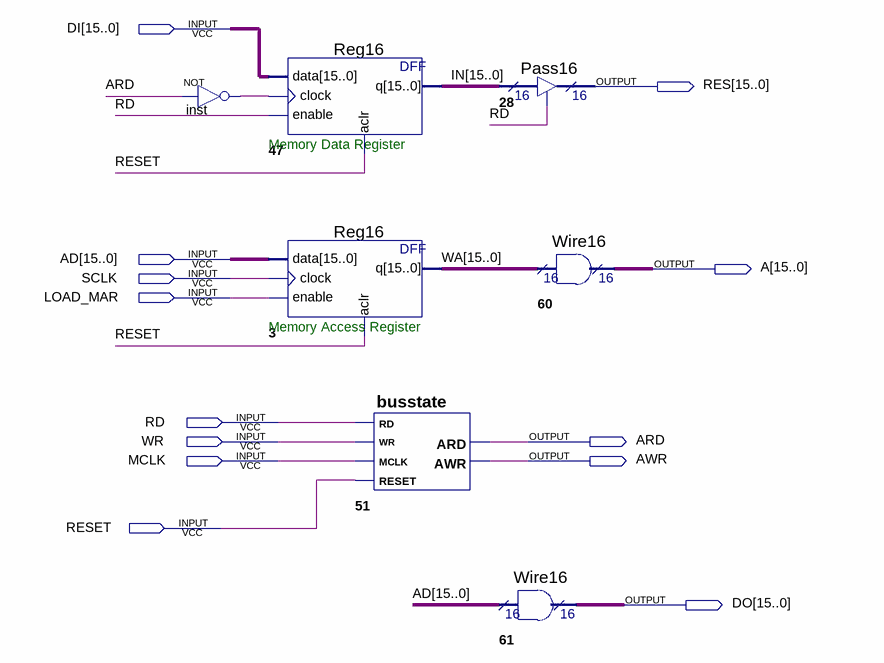
[diagram p0: schematic sheet]
// Quartus schematic busctrll.bdf as structural Verilog: 7 symbols, 13 pins
module busctrll (
  input  [15:0] DI,
  input  [15:0] AD,
  input  SCLK,
  input  LOAD_MAR,
  input  RD,
  input  WR,
  input  MCLK,
  input  RESET,
  output [15:0] RES,
  output [15:0] A,
  output ARD,
  output AWR,
  output [15:0] DO
);

  wire inst_out;
  wire [15:0] IN, WA;

  not inst (inst_out, ARD);
  Reg16 u_47 (.data(DI), .clock(inst_out), .enable(RD), .aclr(RESET), .q(IN));
  Reg16 u_3 (.data(AD), .clock(SCLK), .enable(LOAD_MAR), .aclr(RESET), .q(WA));
  busstate u_51 (.RD(RD), .WR(WR), .MCLK(MCLK), .RESET(RESET), .ARD(ARD), .AWR(AWR));
  Pass16 u_28 (.enabledt(RD), .data(IN), .tridata(RES));
  Wire16 u_61 (.data0_(AD), .result(DO));
  Wire16 u_60 (.data0_(WA), .result(A));

  // Notes on the sheet:
  //   Memory Data Register
  //   Memory Access Register
endmodule
